# EAGLE design Power Supply V3 (EAGLE 9.1.1)

## Sheet 1 of 2
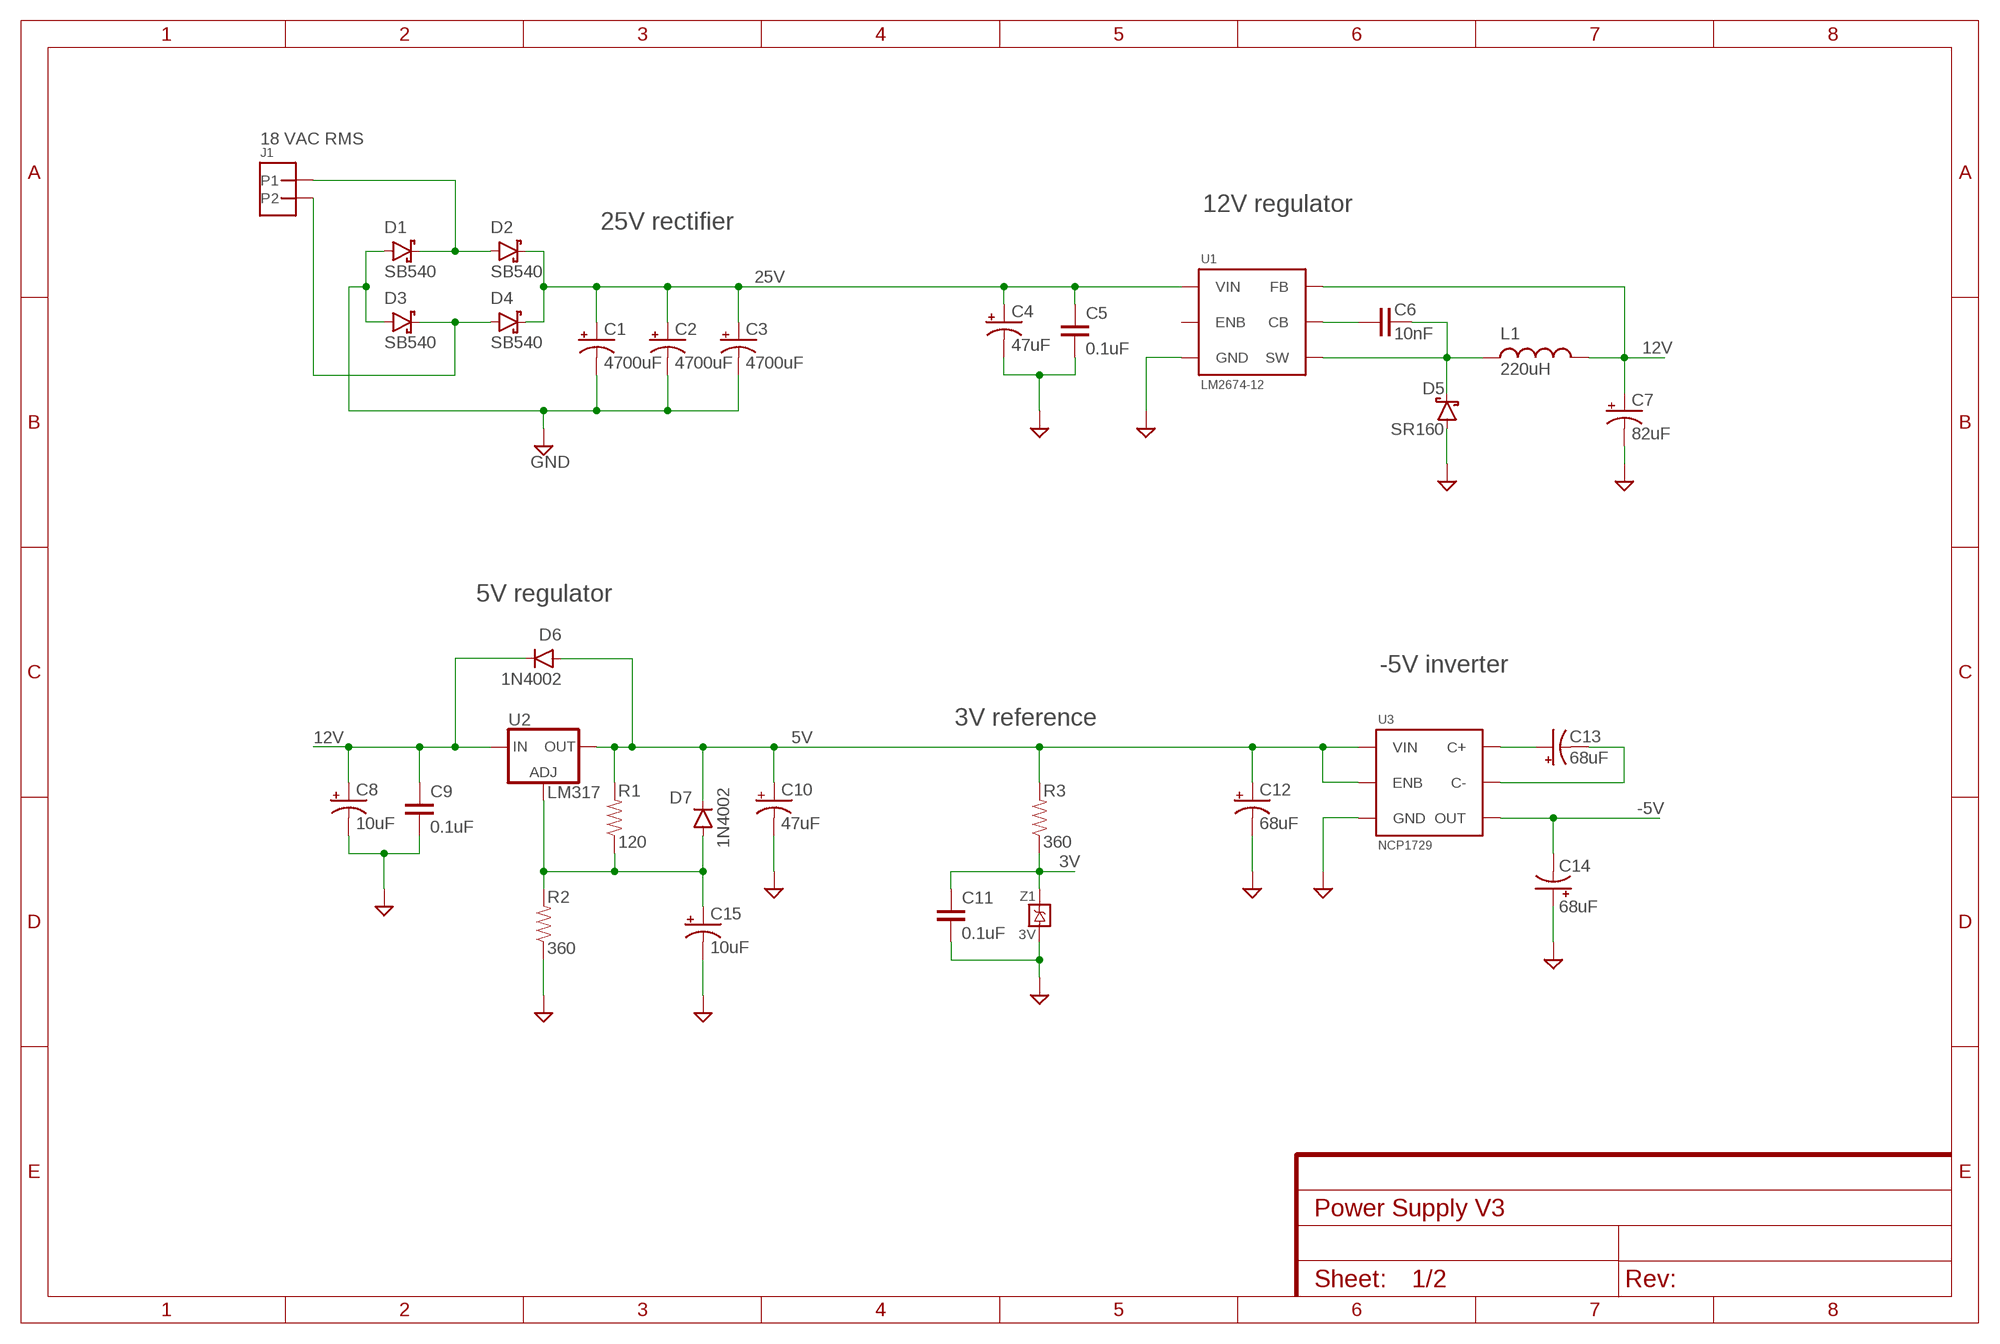
[diagram p0: schematic, sheet 1]
FRAME1 (FRAME-A4L): CNAME: Power Supply; CREVISION: 1; DESIGNER: Isaac Rex

### Parts
C1  4700uF  RADIAL_POL10MM_LEAD-22MM_DIA  [10MM-LEAD_22MM-DIA]
C2  4700uF  RADIAL_POL10MM_LEAD-22MM_DIA  [10MM-LEAD_22MM-DIA]
C3  4700uF  RADIAL_POL10MM_LEAD-22MM_DIA  [10MM-LEAD_22MM-DIA]
C4  47uF  RADIAL_POL2.5MM_LEAD-6.3MM_DIA  [2.5MM_LEAD-6.3MM_DIA]
C5  0.1uF  NON_POL_0805/2012  [0805]
C6  10nF  NON_POL_1206/3216  [1206]
C7  82uF  RADIAL_POL2.5MM_LEAD-6.3MM_DIA  [2.5MM_LEAD-6.3MM_DIA]
C8  10uF  SMD_POL_6032  [6032-28]
C9  0.1uF  NON_POL_0805/2012  [0805]
C10  47uF  RADIAL_POL2.5MM_LEAD-6.3MM_DIA  [2.5MM_LEAD-6.3MM_DIA]
C11  0.1uF  NON_POL_0805/2012  [0805]
C12  68uF  SMD_POL_NICHICON_RFS  [ALUM_SMD_SMALL]
C13  68uF  SMD_POL_NICHICON_RFS  [ALUM_SMD_SMALL]
C14  68uF  SMD_POL_NICHICON_RFS  [ALUM_SMD_SMALL]
C15  10uF  SMD_POL_6032  [6032-28]
D1  SB540  SCHOTTKY_DIODE_DO-201  [DO201-15]
D2  SB540  SCHOTTKY_DIODE_DO-201  [DO201-15]
D3  SB540  SCHOTTKY_DIODE_DO-201  [DO201-15]
D4  SB540  SCHOTTKY_DIODE_DO-201  [DO201-15]
D5  SR160  SCHOTTKY_DIODE_DO-41  [DO41-10]
D6  1N4002  THROUGH_HOLE_DO-41  [DO41-10]
D7  1N4002  THROUGH_HOLE_DO-41  [DO41-10]
J1  MOLEX_46999-0126  [2P_MOLEX_5566]
L1  220uH  1200LRS  [1200LRS]
R1  120  THROUGH_HOLE_1/4W  [1/4W_0.4]
R2  360  THROUGH_HOLE_1/4W  [1/4W_0.4]
R3  360  THROUGH_HOLE_1/4W  [1/4W_0.4]
U1  LM2674-12  LM2674_SOIC-8  [SOIC-8]
U2  LM317  LM317_TO-220  [TO-220]
U3  NCP1729  [TSOP-6]
Z1  3V  LM4040_TO-92  [TO-92_AMMO]

### Nets
3V: C11.1 R3.P$1 Z1.2(V+) ; also sheet 2
5V [supply]: C10.+ C12.+ D6.A D7.C R1.P$2 R3.P$2 U2.2(OUT) U3.2(VIN) U3.5(ENB) ; also sheet 2
12V [supply]: C7.+ C8.+ C9.1 D6.C L1.3 U1.4(FB) U2.3(IN) ; also sheet 2
25V [supply]: C1.+ C2.+ C3.+ C4.+ C5.1 D2.C D4.C U1.7(VIN) ; also sheet 2
-5V [supply]: C14.- U3.1(OUT) ; also sheet 2
CB: C6.1 U1.1(CB)
GND: C1.- C2.- C3.- C4.- C5.2 C7.- C8.- C9.2 C10.- C11.2 C12.- C14.+ C15.- D1.A D3.A D5.A R2.P$1 U1.6(GND) U3.4(GND) Z1.1(V-) ; also sheet 2
N$1 [supply]: D1.C D2.A J1.1
N$2 [supply]: D3.C D4.A J1.2
N$18 [supply]: C13.+ U3.6(C+)
N$21 [supply]: C13.- U3.3(C-)
SET1 [supply]: C15.+ D7.A R1.P$1 R2.P$2 U2.1(ADJ)
SW [supply]: C6.2 D5.C L1.1 U1.8(SW)
Unconnected: U1.5(ENB)

### Notes on the sheet
- 18 VAC RMS
- 12V regulator
- 25V rectifier
- 5V regulator
- -5V inverter
- 3V reference

## Sheet 2 of 2
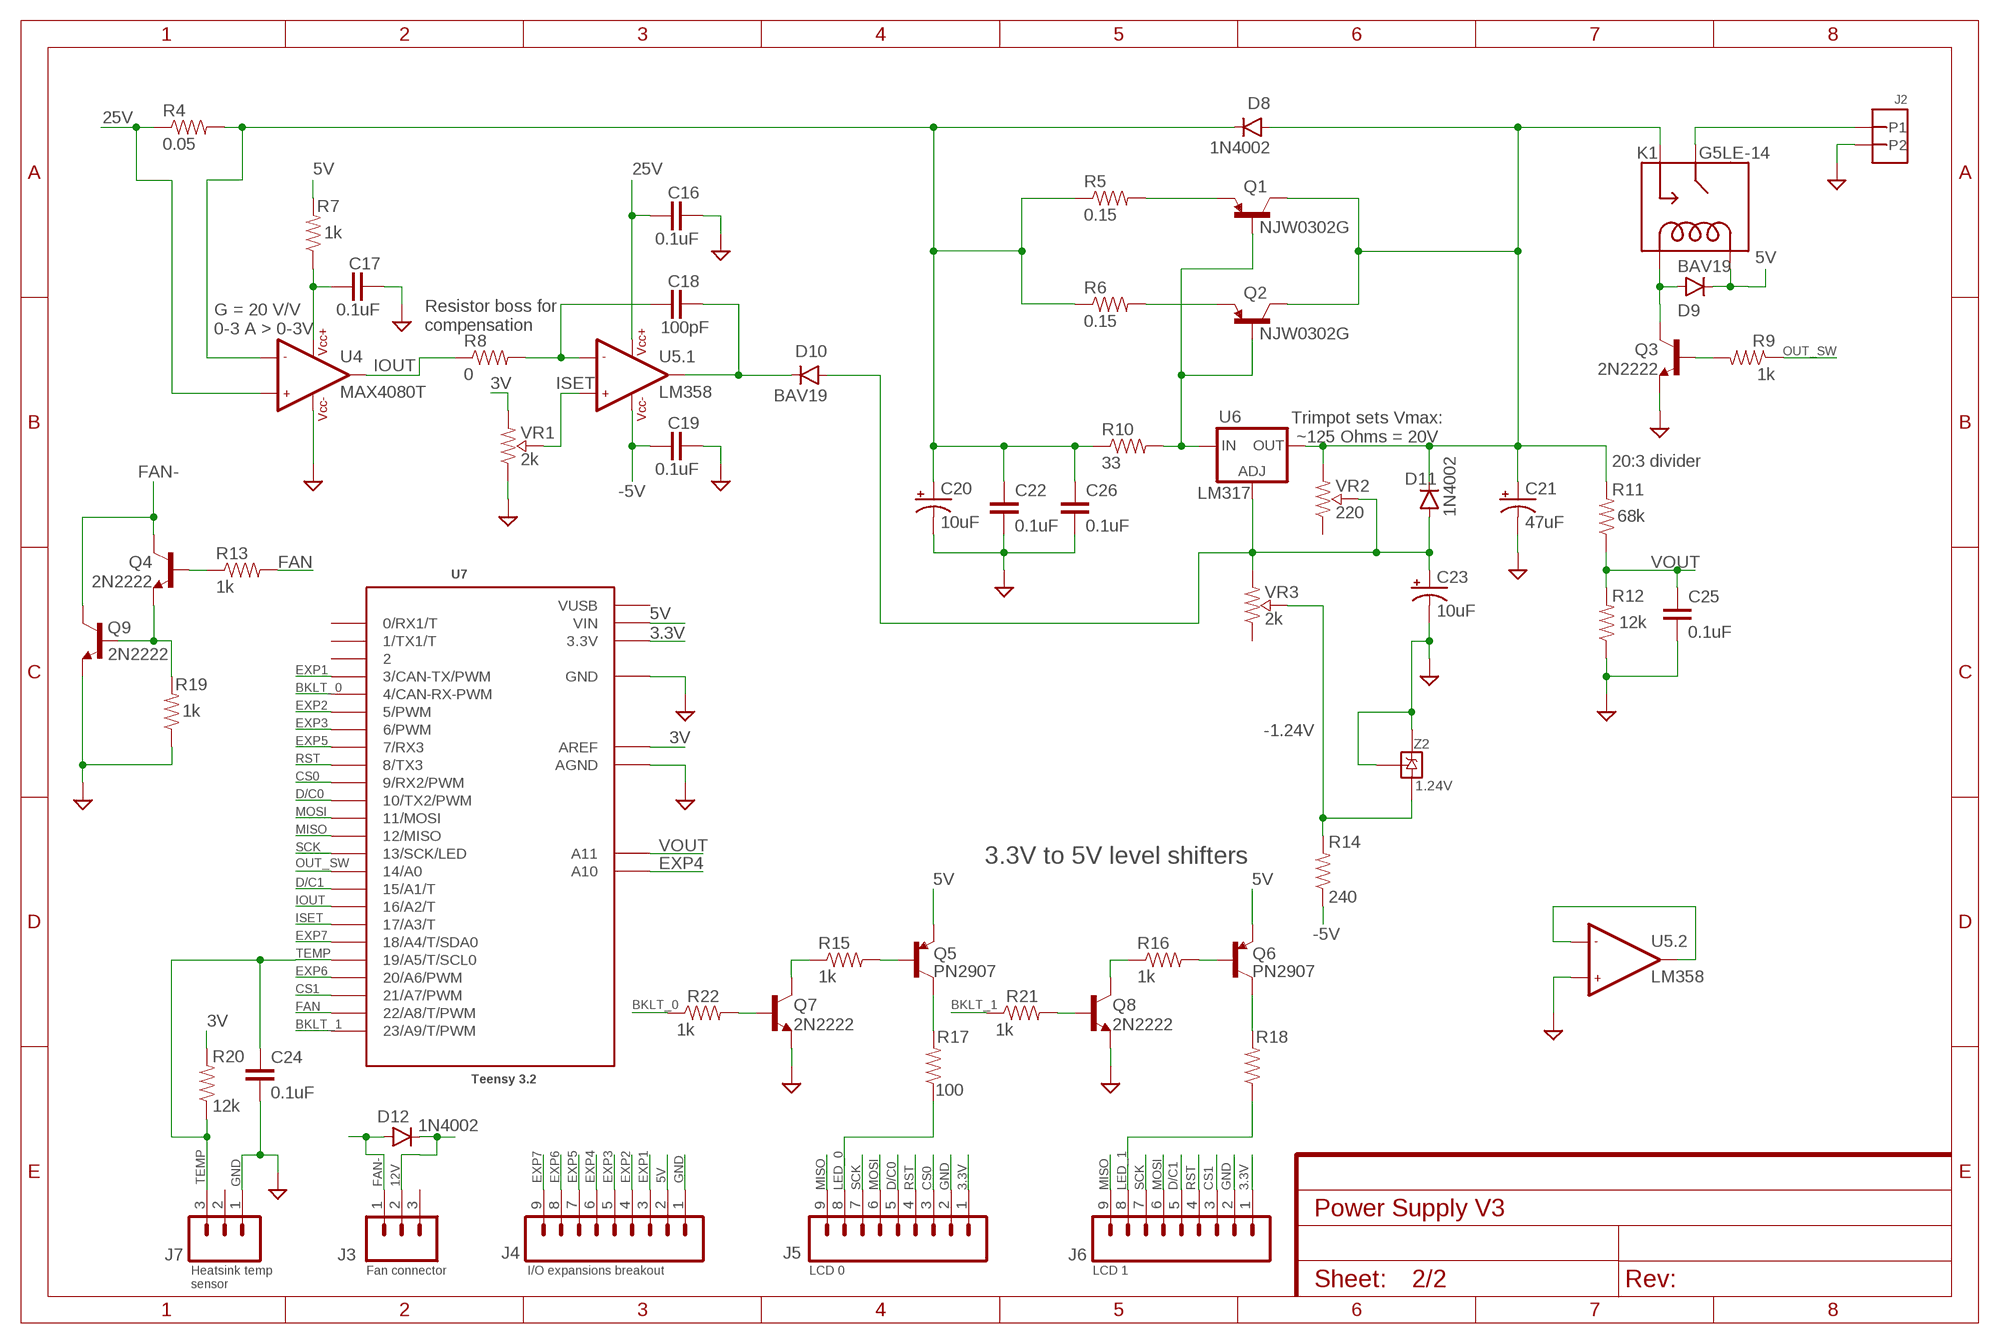
[diagram p1: schematic, sheet 2]
FRAME2 (FRAME-A4L): CNAME: Power Supply; CREVISION: 1; DESIGNER: Isaac Rex

### Parts
C16  0.1uF  NON_POL_0805/2012  [0805]
C17  0.1uF  NON_POL_0805/2012  [0805]
C18  100pF  NON_POL_2.5MM  [2.54MM_LEAD]
C19  0.1uF  NON_POL_0805/2012  [0805]
C20  10uF  SMD_POL_6032  [6032-28]
C21  47uF  RADIAL_POL2.5MM_LEAD-6.3MM_DIA  [2.5MM_LEAD-6.3MM_DIA]
C22  0.1uF  NON_POL_0805/2012  [0805]
C23  10uF  SMD_POL_6032  [6032-28]
C24  0.1uF  NON_POL_0805/2012  [0805]
C25  0.1uF  NON_POL_0805/2012  [0805]
C26  0.1uF  NON_POL_0805/2012  [0805]
D8  1N4002  THROUGH_HOLE_DO-41  [DO41-10]
D9  BAV19  THROUGH_HOLE_DO-35  [DO35-10]
D10  BAV19  THROUGH_HOLE_DO-35  [DO35-10]
D11  1N4002  THROUGH_HOLE_DO-41  [DO41-10]
D12  1N4002  THROUGH_HOLE_DO-41  [DO41-10]
J2  MOLEX_46999-0126  [2P_MOLEX_5566]
J3  3P_XH2.54  [XH-3P_LOCK]
J4  9P_XH2.54LOCK  [9P_XH2.54_LOCK]
J5  9P_XH2.54LOCK  [9P_XH2.54_LOCK]
J6  9P_XH2.54LOCK  [9P_XH2.54_LOCK]
J7  3P_XH2.54  [XH-3P_LOCK]
K1  G5LE-14  RELAY_G5LE-14  [SPST_RELAY_NO]
Q1  NJW0302G  PNP_NJW0302G  [TO-247AD-V]
Q2  NJW0302G  PNP_NJW0302G  [TO-247AD-V]
Q3  2N2222  NPN_2N2222  [TO-92]
Q4  2N2222  NPN_2N2222  [TO-92]
Q5  PN2907  PNP_PN2907  [TO-92_AMMO]
Q6  PN2907  PNP_PN2907  [TO-92_AMMO]
Q7  2N2222  NPN_2N2222  [TO-92]
Q8  2N2222  NPN_2N2222  [TO-92]
Q9  2N2222  NPN_2N2222  [TO-92]
R4  0.05  SMD_2512  [2512]
R5  0.15  THROUGH_HOLE_1/2W  [1/2W_0.5]
R6  0.15  THROUGH_HOLE_1/2W  [1/2W_0.5]
R7  1k  THROUGH_HOLE_1/4W  [1/4W_0.4]
R8  0  THROUGH_HOLE_1/4W  [1/4W_0.4]
R9  1k  THROUGH_HOLE_1/4W  [1/4W_0.4]
R10  33  THROUGH_HOLE_1/4W  [1/4W_0.4]
R11  68k  SMD_0805  [0805]
R12  12k  SMD_0805  [0805]
R13  1k  THROUGH_HOLE_1/4W  [1/4W_0.4]
R14  240  THROUGH_HOLE_1/4W  [1/4W_0.4]
R15  1k  THROUGH_HOLE_1/4W  [1/4W_0.4]
R16  1k  THROUGH_HOLE_1/4W  [1/4W_0.4]
R17  100  THROUGH_HOLE_1/4W  [1/4W_0.4]
R18  100  THROUGH_HOLE_1/4W  [1/4W_0.4]
R19  1k  THROUGH_HOLE_1/4W  [1/4W_0.4]
R20  12k  SMD_0805  [0805]
R21  1k  THROUGH_HOLE_1/4W  [1/4W_0.4]
R22  1k  THROUGH_HOLE_1/4W  [1/4W_0.4]
U4  MAX4080T  MAX4080  [SO08]
U5  LM358  OP-AMP_DUAL_LM358  [DIL-08]
U6  LM317  LM317_TO-220  [TO-220]
U7  Teensy 3.2  TEENSY_3.1_DIL+4  [TEENSY3-DIL+4]
VR1  2k  OFFBOARD_POTXH-3P_LOCK  [XH-3P_LOCK]
VR2  220  TRIM_POTS_THROUGH_HOLE_2.54MM  [THROUGH_HOLE_TRIMPOT]
VR3  2k  OFFBOARD_POTXH-3P_LOCK  [XH-3P_LOCK]
Z2  1.24V  ADJ_VOLTAGE_REF_AZ431L  [TO-92_AMMO]

### Nets
3.3V: J5.1 J6.1 U7.3.3V
3V: R20.2 U7.AREF VR1.3(E) ; also sheet 1
5V [supply]: D9.C J4.2 K1.COIL2 Q5.1(E) Q6.1(E) R7.P$2 U7.VIN ; also sheet 1
12V [supply]: D12.C J3.2 ; also sheet 1
25V [supply]: C16.1 R4.1 U4.1(+IN1) U5.8(.1:VCC+) ; also sheet 1
-1.24V: R14.P$2 VR3.2(S) Z2.2(A)
-5V [supply]: C19.1 R14.P$1 U5.4(.1:VCC-) ; also sheet 1
BKLT_0: R22.P$1 U7.4(4/CAN-RX-PWM)
BKLT_1: R21.P$1 U7.23/A9(23/A9/T/PWM)
CS0: J5.3 U7.9(9/RX2/PWM)
CS1: J6.3 U7.21/A7(21/A7/PWM)
D/C0: J5.5 U7.10(10/TX2/PWM)
D/C1: J6.5 U7.15/A1(15/A1/T)
EXP1: J4.3 U7.3(3/CAN-TX/PWM)
EXP2: J4.4 U7.5(5/PWM)
EXP3: J4.5 U7.6(6/PWM)
EXP4: J4.6 U7.A10
EXP5: J4.7 U7.7(7/RX3)
EXP6: J4.8 U7.20/A6(20/A6/PWM)
EXP7: J4.9 U7.18/A4(18/A4/T/SDA0)
FAN: R13.P$2 U7.22/A8(22/A8/T/PWM)
FAN-: D12.A J3.1 Q4.3(C) Q9.3(C)
GND: C16.2 C17.2 C19.2 C20.- C21.- C22.2 C23.- C24.2 C25.2 C26.2 J2.2 J4.1 J5.2 J6.2 J7.1 Q3.1(E) Q7.1(E) Q8.1(E) Q9.1(E) R12.1 R19.P$1 U4.4(VCC-) U5.5(.2:+IN2) U7.AGND U7.GND VR1.1(A) Z2.1(REF) Z2.3(C) ; also sheet 1
IN: Q1.1(B) Q2.1(B) R10.P$2 U6.3(IN) ; also sheet 1
IOUT: R8.P$1 U4.5(OUT1) U7.16/A2(16/A2/T)
ISET: U5.3(.1:+IN1) U7.17/A3(17/A3/T) VR1.2(S)
LED_0: J5.8 R17.P$1
LED_1: J6.8 R18.P$1
MISO: J5.9 J6.9 U7.12(12/MISO)
MOSI: J5.6 J6.6 U7.11(11/MOSI)
N$5: C17.1 R7.P$1 U4.2(VCC+)
N$7: C20.+ C22.1 C26.1 D8.C R4.2 R5.P$1 R6.P$1 R10.P$1 U4.8(-IN1)
N$8: C18.2 D10.C U5.1(.1:OUT1)
N$9: Q1.3(E) R5.P$2
N$10: Q2.3(E) R6.P$2
N$11: C18.1 R8.P$2 U5.2(.1:-IN1)
N$12: Q8.2(B) R21.P$2
N$13 [supply]: J2.1 K1.COM(MAIN)
N$14: Q7.2(B) R22.P$2
N$15: D9.A K1.COIL1 Q3.3(C)
N$19: Q3.2(B) R9.P$2
N$20: Q5.3(C) R17.P$2
N$22: Q7.3(C) R15.P$1
N$23: Q6.3(C) R18.P$2
N$24: Q5.2(B) R15.P$2
N$25: Q8.3(C) R16.P$1
N$26: Q6.2(B) R16.P$2
N$27: Q4.1(E) Q9.2(B) R19.P$2
N$28: Q4.2(B) R13.P$1
OP2: U5.6(.2:-IN2) U5.7(.2:OUT2)
OUT [supply]: C21.+ D8.A D11.C K1.NO Q1.2(C) Q2.2(C) R11.2 U6.2(OUT) VR2.3(E) ; also sheet 1
OUT_SW: R9.P$1 U7.14/A0
RST: J5.4 J6.4 U7.8(8/TX3)
SCK: J5.7 J6.7 U7.13(13/SCK/LED)
SET: C23.+ D10.A D11.A U6.1(ADJ) VR2.2(S) VR3.3(E) ; also sheet 1
TEMP: C24.1 J7.3 R20.1 U7.19/A5(19/A5/T/SCL0)
VOUT: C25.1 R11.1 R12.2 U7.A11
Unconnected: J3.3 J7.2 U7.0(0/RX1/T) U7.1(1/TX1/T) U7.2 VR2.1(A) VR3.1(A)

### Notes on the sheet
- Resistor boss for 
  compensation
- G = 20 V/V
  0-3 A > 0-3V
- Trimpot sets Vmax:
   ~125 Ohms = 20V
- 20:3 divider
- 3.3V to 5V level shifters
- Heatsink temp 
  sensor
- Fan connector | I/O expansions breakout | LCD 0 | LCD 1

## Power pins joined to a net without a drawn wire
VUSB: U7.VUSB

## Library data of the parts
C1-C4 C7 C10 C21 = Capacitors:RADIAL_POL
C5 C6 C9 C11 C16-C19 C22 C24-C26 = Capacitors:NON_POL
C8 C12-C15 C20 C23 = Capacitors:SMD_POL
D1-D5 = Diodes:SCHOTTKY_DIODE
D6-D12 = Diodes:THROUGH_HOLE: DIODE silicon-epitaxial planar diode
J1 J2 = Connectors:MOLEX_46999-0126: 2-pin
J3 J7 = Connectors:3P_XH2.54: 3 pin
J4-J6 = Connectors:9P_XH2.54: 9-pin
K1 = Electromechanical:RELAY
L1 = Inductors:1200LRS: Murata 1200LRS series inductors
Q1 Q2 = Transistors:PNP; SPICEMODEL: NJW0302G; SPICEPREFIX: Q
Q3 Q4 Q7-Q9 = Transistors:NPN
Q5 Q6 = Transistors:PNP
R1-R3 R5 R6 R8-R10 R13-R18 R21 R22 = Resistors:THROUGH_HOLE
R4 R11 R12 R20 = Resistors:SMD
R7 R19 = Resistors:THROUGH_HOLE; SPICEPREFIX: R
U1 = Voltage Regulators:LM2674: Switching voltage regulator; VALUE: LM2674-
U2 U6 = Voltage Regulators:LM317: Linear voltage regulator; SPICEMODEL: LM317; SPICEPREFIX: X
U3 = Voltage Regulators:NCP1729: Switched capacitor voltage inverter
U4 = Amplifiers:MAX4080: Current sense amplifier
U5 = Amplifiers:OP-AMP_DUAL: Op-amp
U7 = Teensy Boards:TEENSY_3.1_DIL+4: Teensy 3.1 and 3.2 in a DIL package with the inner 4 pins
VR1 VR3 = Potentiometer:OFFBOARD_POT; SPICEMODEL: POT; SPICEPREFIX: X
VR2 = Potentiometer:TRIM_POTS
Z1 = Voltage Reference:LM4040
Z2 = Voltage Reference:ADJ_VOLTAGE_REF

## Net classes
1 supply: width 0.305 mm, clearance 0.305 mm

## Board
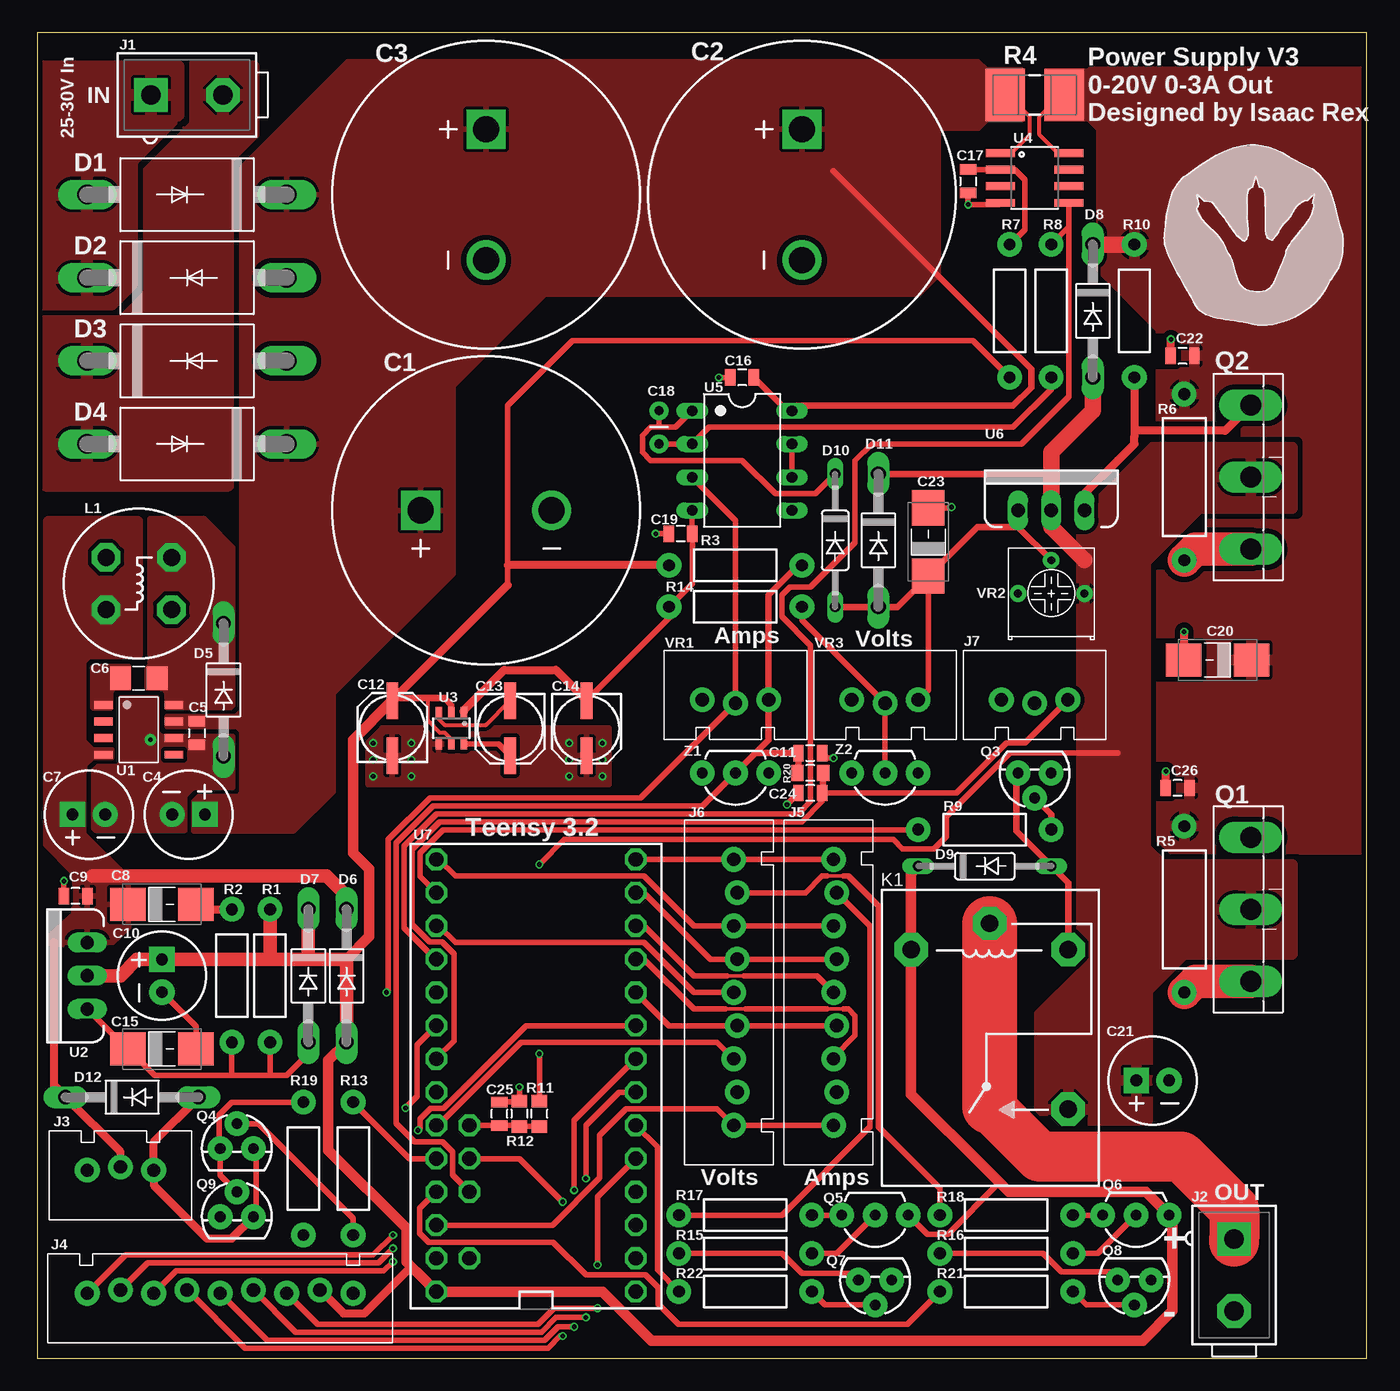
[diagram p2: board, top side]
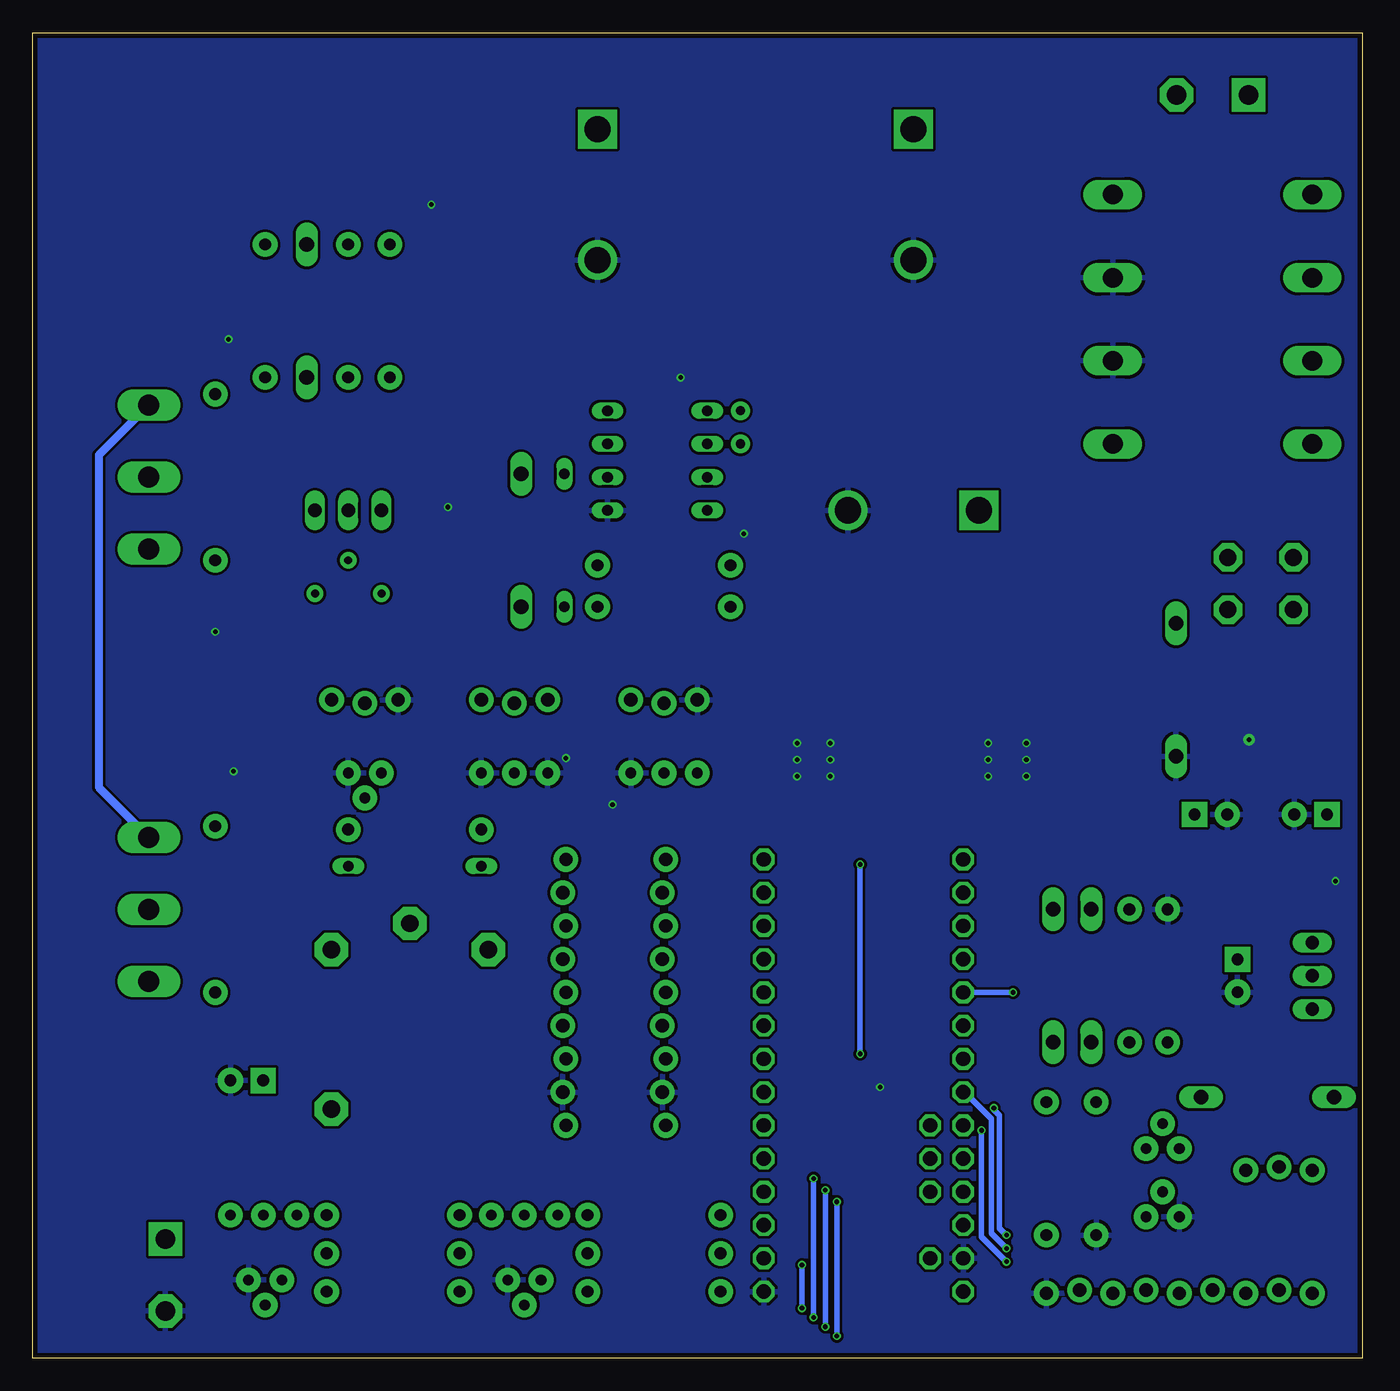
[diagram p3: board, bottom side, seen from below]

Size 101.58 x 101.27 mm. Coordinates in mm from the lower left corner, seen from the top.
Outline: 0,0 101.58,0 101.58,101.27 0,101.27 0,0
Copper layers (1*16): Top 0.035559375mm / dielectric 1.6mm / Bottom 0.035559375mm
Design rules "OshPark-2layer *": minimum track width 8mil, minimum drill 10mil, track to track 8mil, track to pad 8mil, pad to pad 8mil, via to via 8mil, smd to smd 6mil, copper to edge 15mil, drill to drill 6mil, minimum pad ring 5mil, minimum via ring 5mil, stop-mask expansion 2.5mil, vias tented up to drill 0mil, thermal gap 10mil

### Footprints (pad centres in the part's own frame; a part is rotated, then mirrored left to right if it is on the bottom)
10MM-LEAD_22MM-DIA = drill 2 square: + 5,0 | drill 2: - -5,0
2.5MM_LEAD-6.3MM_DIA = drill 0.9 pad 1.93 square: + 1.25,0 | drill 0.9 pad 1.93: - -1.25,0
0805 = smd 0.8 x 1.25: 1 -0.9,0; 2 0.9,0
1206 = smd 1.6 x 1.8: 1 -1.4,0; 2 1.4,0
6032-28 = smd 2.7 x 2.5: + 2.6,0; - -2.6,0
ALUM_SMD_SMALL = smd 2.8 x 0.9: + 2.1,-0.2; - -2.1,-0.2
2.54MM_LEAD = drill 0.7 pad 1.422: 1 -1.27,0; 2 1.27,0
DO201-15 = drill 1.499 long: A 7.62,0; C -7.62,0
DO41-10 = drill 1.118 long: A 5.08,0; C -5.08,0
DO35-10 = drill 0.813 long: A 5.08,0; C -5.08,0
2P_MOLEX_5566 = drill 1.5 pad 2.54 square: 1 0,2.75 | drill 1.5 pad 2.54 octagon: 2 0,-2.75
XH-3P_LOCK = drill 1.016 pad 1.88: 1 -2.54,0.127; 2 0,-0.127; 3 2.54,0.127
9P_XH2.54_LOCK = drill 1.016 pad 1.88: 1 0,0.127; 2 2.54,-0.127; 3 5.08,0.127; 4 7.62,-0.127; 5 10.16,0.127; 6 12.7,-0.127; 7 15.24,0.127; 8 17.78,-0.127; 9 20.32,0.127
SPST_RELAY_NO = drill 1.32 pad 2.54 octagon: COIL1 -6.45,6.25; COIL2 -6.45,-5.75; COM -8.45,0.25; NO 5.75,6.25
1200LRS = drill 1.3 pad 2.184 octagon: 1 -2,2.5; 2 -2,-2.5; 3 2,-2.5; 4 2,2.5
TO-247AD-V = drill 1.6 long: 1 -5.5,-2.54; 2 0,-2.54; 3 5.5,-2.54
TO-92 = drill 0.813 pad 1.88: 1 -1.27,0; 2 0,1.905; 3 1.27,0
TO-92_AMMO = drill 0.813 pad 1.88: 1 -2.54,0; 2 0,0; 3 2.54,0
1/4W_0.4 = drill 0.9 pad 1.88: P$1 -5.08,0; P$2 5.08,0
2512 = smd 3 x 4: 1 -2.25,0; 2 2.25,0
1/2W_0.5 = drill 0.9 pad 1.88: P$1 -6.35,0; P$2 6.35,0
0805' = smd 0.95 x 1.2: 1 -0.975,0; 2 0.975,0
SOIC-8 = smd 0.6 x 1.4: 1 -1.905,-2.7; 2 -0.635,-2.7; 3 0.635,-2.7; 4 1.905,-2.7; 5 1.905,2.7; 6 0.635,2.7; 7 -0.635,2.7; 8 -1.905,2.7
TO-220 = drill 1.016 long: 1 -2.54,0; 2 0,0; 3 2.54,0
TSOP-6 = smd 0.508 x 0.8: 1 -0.95,-1.212; 2 0,-1.212; 3 0.95,-1.212; 4 0.95,1.212; 5 0,1.212; 6 -0.95,1.212
SO08 = smd 0.61 x 2.21: 1 -1.905,-2.616; 2 -0.635,-2.616; 3 0.635,-2.616; 4 1.905,-2.616; 5 1.905,2.616; 6 0.635,2.616; 7 -0.635,2.616; 8 -1.905,2.616
DIL-08 = drill 0.813 long: 1 -3.81,-3.81; 2 -1.27,-3.81; 3 1.27,-3.81; 4 3.81,-3.81; 5 3.81,3.81; 6 1.27,3.81; 7 -1.27,3.81; 8 -3.81,3.81
TEENSY3-DIL+4 = drill 1.1 octagon: 0 -7.62,13.97; 1 -7.62,11.43; 2 -7.62,8.89; 3 -7.62,6.35; 3.3V 7.62,11.43; 4 -7.62,3.81; 5 -7.62,1.27; 6 -7.62,-1.27; 7 -7.62,-3.81; 8 -7.62,-6.35; 9 -7.62,-8.89; 10 -7.62,-11.43; 11 -7.62,-13.97; 12 -7.62,-16.51; 13 7.62,-16.51; 14/A0 7.62,-13.97; 15/A1 7.62,-11.43; 16/A2 7.62,-8.89; 17/A3 7.62,-6.35; 18/A4 7.62,-3.81; 19/A5 7.62,-1.27; 20/A6 7.62,1.27; 21/A7 7.62,3.81; 22/A8 7.62,6.35; 23/A9 7.62,8.89; A10 5.08,6.35; A11 5.08,3.81; AGND 7.62,13.97; AREF 5.08,8.89; GND -7.62,16.51; VIN 7.62,16.51; VUSB 5.08,13.97
THROUGH_HOLE_TRIMPOT = drill 0.6 pad 1.27: 1 -2.54,0; 2 0,2.54; 3 2.54,0

### Placement (x,y rotation side)
C1  34.29,64.77 180 top
C2  58.42,88.9 90 top
C3  34.29,88.9 90 top
C4  11.56,41.53 0 top
C5  12.19,47.75 270 top
C6  7.75,51.94 0 top
C7  3.94,41.53 180 top
C8  9.53,34.67 180 top
C9  2.92,35.31 180 top
C10  9.53,29.21 90 top
C11  59.05,46.23 0 top
C12  26.92,48.13 90 top
C13  36.32,48.13 270 top
C14  42.16,48.13 270 top
C15  9.53,23.62 180 top
C16  53.85,74.93 180 top
C17  71.12,89.92 270 top
C18  47.5,71.12 90 top
C19  49.15,62.99 180 top
C20  90.17,53.34 0 top
C21  85.22,21.21 180 top
C22  87.5,76.58 180 top
C23  68.07,62.36 270 top
C24  59.05,43.18 180 top
C25  35.31,18.67 90 top
C26  87.12,43.56 180 top
D1  11.43,82.55 0 top
D2  11.43,88.9 180 top
D3  11.43,76.2 0 top
D4  11.43,69.85 180 top
D5  14.22,51.05 270 top
D6  23.62,29.21 270 top
D7  20.7,29.21 270 top
D8  80.64,80.01 270 top
D9  72.39,37.59 0 top
D10  60.96,62.48 270 top
D11  64.26,62.48 270 top
D12  7.24,19.94 0 top
J1  11.43,96.52 90 top
J2  91.44,6.35 0 top
J3  6.35,14.48 180 top
J4  24.13,5.08 180 top
J5  60.96,17.78 90 top
J6  53.34,17.78 90 top
J7  76.2,50.16 0 top
K1  72.52,24.77 270 top
L1  7.75,59.18 270 top
Q1  95.25,34.29 270 top
Q2  95.25,67.31 270 top
Q3  76.2,44.7 180 top
Q4  15.24,16 0 top
Q5  64.01,10.92 180 top
Q6  83.95,10.92 180 top
Q7  64.01,5.97 180 top
Q8  83.82,5.97 180 top
Q9  15.24,10.79 0 top
R1  17.78,29.21 90 top
R2  14.86,29.21 270 top
R3  53.34,60.58 180 top
R4  76.2,96.52 0 top
R5  87.63,34.29 270 top
R6  87.63,67.31 270 top
R7  74.3,80.01 270 top
R8  77.47,80.01 270 top
R9  72.39,40.39 0 top
R10  83.82,80.01 270 top
R11  68k  [0805']  38.35,18.67 90 top
R12  12k  [0805']  36.83,18.67 270 top
R13  24.13,14.48 90 top
R14  53.34,57.4 0 top
R15  54.1,8 0 top
R16  74.04,8 0 top
R17  54.1,10.92 0 top
R18  74.04,10.92 0 top
R19  20.32,14.48 90 top
R20  12k  [0805']  59.05,44.7 180 top
R21  74.04,5.08 0 top
R22  54.1,5.08 0 top
U1  7.75,48.01 270 top
U2  3.81,29.21 90 top
U3  31.62,48.13 180 top
U4  76.2,90.17 270 top
U5  53.85,68.58 270 top
U6  77.47,64.77 0 top
U7  38.1,21.59 180 top
VR1  53.34,50.16 0 top
VR2  77.47,58.42 0 top
VR3  64.77,50.16 0 top
Z1  53.34,44.7 180 top
Z2  64.77,44.7 180 top

### Tracks (layer width: path | path; a pad name or v marks a point on that pad's centre or on a via)
3.3V
  Top 0.406: J5.1 J6.1 51.94,19.05 44.99,19.05 42.97,17.02 42.97,13.76 39.37,10.16 U7.3.3V
3V
  Top 0.406: U7.AREF 31.71,14.01 31.71,15.75 30.95,16.51 28.83,16.51 27.42,17.92 27.42,39.37 30.24,42.19 50.83,42.19 Z1.2
  Top 0.508: Z1.2 54.48,45.85 | 54.48,45.85 55.87,47.23 55.88,47.23 55.88,48.5 VR1.3 55.88,58.29 58.17,60.58 R3.P$1 | R20.2 58.16,44.78 C11.1 54.86,46.23 54.48,45.85
5V
  Top 0.305: 29.84,50.42 29.84,48.7 30.77,47.78 31.15,47.78 31.62,47.3 U3.5
  Top 0.406: R7.P$2 71.5,77.72 40.89,77.72 35.95,72.78 35.95,60.58 35.95,59.05 | Q5.1 68,9.47 69.56,9.47 73.44,13.35 73.44,13.49
  Top 0.508: U3.2 31.62,49.91 31.11,50.42 29.84,50.42 27.31,50.42 C12.+
  Top 0.61: R3.P$2 35.95,60.58 | 35.95,59.05 C12.+ | 86.74,10.67 Q6.1 | J4.2 23.39,3.4 24.99,3.4 28.57,6.99
  Top 0.813: D9.C 66.77,37.05 K1.COIL2 66.77,20.16 72.58,14.35 73.44,13.49 74.23,12.7 84.71,12.7 Q6.1 | 86.74,10.67 86.74,3.61 84.45,1.32 46.94,1.32 43.18,5.08 U7.VIN 29.21,6.35 28.57,6.99 28.19,7.37 28.19,9.91 22.23,15.88 22.23,22.73 D6.A | C12.+ 24.13,47.24 24.13,38.61 25.36,37.38 25.36,32.2 23.62,30.46
  Top 1.016: R1.P$2 17.78,30.46 | U2.2 6.35,29.21 7.6,30.46 C10.+ 17.78,30.46 | 20.7,30.46 23.62,30.46 D6.A | D7.C 20.7,30.46 | 17.78,30.46 20.7,30.46
12V
  Top 0.61: J3.2 6.35,15.75 D12.C 1.27,20.83 1.27,31.75
  Top 1.016: 4.19,36.83 22.1,36.83 23.62,35.31 D6.C
  pour Top (isolate 0.305, rank 3, no thermals): 7.87,53.85 7.87,63.88 arc90 7.62,64.14 0.89,64.14 arc90 0.64,63.88 0.64,57.02 0.64,40.13 3.56,40.13 3.56,44.83 4.45,45.72 5.71,45.72 5.71,46.48 4.19,46.48 3.56,47.12 3.56,53.21 3.94,53.59 7.62,53.59 arc90
  pour Top: 5.62,31.62 7.24,33.17 7.24,36.83 6.73,36.83 3.56,40.01 3.56,41.53 0.64,41.53 0.64,39.24 2.79,37.08 2.79,33.89 1.02,32.37 1.02,31.62
25V
  Top 0.305: U4.1 74.42,92.08 75.82,93.47 75.82,94.87 74.17,96.52 | 74.17,96.52 R4.1 | 74.17,96.52
  Top 0.406: 57.29,72.39 U5.8
  Top 0.508: C16.1 57.29,72.39 | 60.83,90.68 75.95,75.56 75.95,74.17 74.55,72.77 58.04,72.77 U5.8
  pour Top (no thermals): 9.91,49.02 9.91,48.26 15.3,48.26 15.62,47.94 15.62,43.18 15.37,42.93 12.38,42.93 11.94,42.48 11.94,40.26 18.67,40.26 18.67,59.44 15.62,59.44 15.62,49.4 15.24,49.02
  pour Top (isolate 0.406): 38.73,81.28 67.31,81.28 68.83,82.8 68.83,99.06 23.75,99.06 16.13,91.44 15.62,90.93 15.62,58.8 15.62,40.26 19.56,40.26 22.61,43.31 22.61,50.8 31.75,59.94 31.75,74.3
  pour Top (no thermals): 75.18,98.42 75.18,94.61 72.52,94.61 71.88,93.98 61.47,93.98 61.47,99.06 71.88,99.06 72.52,98.42
-1.24V
  Top 0.406: R14.P$2 58.42,56.39 VR3.2 Z2.2
-5V
  Top 0.406: R14.P$1 50.05,59.19 C19.1 50.04,63 U5.4
  Top 0.508: C14.- 48.26,56.53 R14.P$1
  Top 0.61: C14.- 39.62,52.58 35.68,52.58 32.57,49.47 U3.1
BKLT_0
  Top 0.406: U7.4 47.37,16.13 47.37,6.73 R22.P$1
BKLT_1
  Top 0.406: U7.23/A9 29.21,11.43 29.21,9.53 29.88,8.85 39.41,8.85 41.91,6.35 46.48,6.35 47.42,5.41 47.42,4.14 48.97,2.59 66.47,2.59 R21.P$1
CB
  pour Top (isolate 0.305, rank 6, no thermals): 6.99,51.18 6.99,52.83 4.32,52.83 4.06,52.58 4.06,49.91 4.32,49.66 5.59,49.66 5.59,50.42 5.59,50.93 5.84,51.18
CS0
  Top 0.254: 52.58,26.67 54.1,26.67 | 60.33,26.67 61.59,26.67
  Top 0.406: 52.58,26.67 50.16,26.67 46.35,30.48 U7.9 | 54.1,26.67 60.33,26.67 | 61.59,26.67 61.98,26.67 62.48,26.16 62.48,24.64 60.83,22.99 J5.3
CS1
  Top 0.406: J6.3 51.94,24.13 36.96,24.13 30.61,17.78 U7.21/A7
D/C0
  Top 0.254: 52.7,29.21 53.98,29.21
  Top 0.406: U7.10 46.35,33.02 50.16,29.21 52.7,29.21 | 53.98,29.21 59.56,29.21 J5.5
D/C1
  Top 0.406: J6.5 50.16,27.94 46.35,31.75 31.94,31.75 30.67,33.02 U7.15/A1
EXP1  (via drill 0.35)
  Top 0.406: U7.3 42.8,12.32 v42.8,7.11 | v42.8,3.81 39.48,3.81 38.26,2.59 21.4,2.59 19.05,4.94 J4.3
  Bottom 0.406: v42.8,3.81 v42.8,7.11
EXP2  (via drill 0.35)
  Top 0.406: U7.5 44.45,20.32 41.91,17.78 v41.91,13.72 | v41.91,3.1 39.63,3.1 38.51,1.98 19.74,1.98 J4.4
  Bottom 0.406: v41.91,3.1 v41.91,13.72
EXP3  (via drill 0.35)
  Top 0.406: U7.6 41.02,18.16 v41.02,12.83 | v41.02,2.39 39.78,2.39 38.76,1.37 17.55,1.37 J4.5
  Bottom 0.406: v41.02,2.39 v41.02,12.83
EXP4  (via drill 0.35)
  Top 0.406: v40.13,1.69 39.94,1.69 39.02,0.76 15.88,0.76 J4.6 | v40.13,11.94 36.83,15.24 U7.A10
  Bottom 0.406: v40.13,1.69 v40.13,11.94
EXP5  (via drill 0.35)
  Top 0.406: J4.7 10.6,6.66 26.47,6.66 v27.18,7.37 | v29.08,17.4 29.25,17.57 29.25,18.29 30.05,19.09 31.03,19.09 37.34,25.4 U7.7
  Bottom 0.406: v27.18,7.37 29.08,9.27 v29.08,17.4
EXP6  (via drill 0.35)
  Top 0.406: v27.18,8.38 26.07,7.27 8.41,7.27 J4.8
  Bottom 0.406: v27.18,8.38 28.32,9.52 28.32,18.28 30.35,20.32 U7.20/A6
EXP7  (via drill 0.35)
  Top 0.406: J4.9 6.74,7.88 25.66,7.88 v27.18,9.4 | U7.18/A4 29.03,23.95 29.03,20 v28.14,19.11
  Bottom 0.406: v27.18,9.4 27.7,9.93 27.7,18.53 28.14,18.97 v28.14,19.11
FAN
  Top 0.406: R13.P$2 28.45,15.24 U7.22/A8
FAN-
  Top 0.406: Q9.3 16.71,11 16.71,15.8 Q4.3
  Top 0.61: D12.A 8.89,16.51 J3.1 8.89,13.21 12.95,9.14 14.86,9.14 Q9.3
GND  (via drill 0.35, 0.35 pad 0.9)
  Top 0.406: C15.- 12.12,25.36 C10.- | C25.2 36.76,19.57 R12.1 v36.83,20.7 | C23.- 69.78,64.96 v69.85,65.02 | C16.2 v52.07,74.93 | U4.4 73.46,88.14 v71.12,88.14 C17.2 | C9.2 2.02,36.44 v2.03,36.45 | v57.28,42.29 57.28,42.3 C24.2 | v60.83,45.85 60.34,45.85 C11.2 | C19.2 v47.24,62.99
  Top 0.61: C20.- 87.63,53.4 v87.63,55.5 | C22.2 v86.6,77.84 v86.61,77.85 | C26.2 v86.22,44.82 v86.23,44.83 | C8.- 12.51,34.29 R2.P$1
  other vias: 8.64,47.24 40.64,46.99 40.64,45.72 40.64,44.45 43.18,44.45 43.18,45.72 43.18,46.99 28.57,46.99 28.57,45.72 28.57,44.45 25.65,44.45 25.65,45.72 25.65,46.99
  pour Top (isolate 0.305, rank 2, no thermals): 9.14,50.42 6.35,50.42 6.35,49.28 6.35,47.12 6.35,45.47 arc-90 6.1,45.21 4.64,45.21 4.32,44.89 4.32,40.58 arc90 4.57,40.32 11.18,40.32 arc90 11.43,40.58 11.43,42.74 12.13,43.43 14.86,43.43 15.49,44.07 15.49,46.99 14.99,47.5 9.78,47.5 9.59,47.5 arc-90 9.14,47.94
  pour Top (isolate 0.305): 25.27,48.13 25.27,43.81 43.69,43.81 43.69,48.13
  pour Bottom (isolate 0.203): 0,0 0,101.22 101.6,101.22 101.6,0
IN
  Top 0.61: R10.P$2 83.82,73.03 83.82,71.75 83.82,71.25 83.82,71.12 83.82,70.99 83.82,70.87 | U6.3 80.01,66.04 82.55,68.58 83.82,69.85 83.82,70.48 83.82,70.87 | Q2.1 90.77,70.87 83.82,70.87
  Bottom 0.61: Q1.1 96.52,43.6 96.52,69 Q2.1
IOUT
  Top 0.406: R8.P$1 78.82,86.44 U4.5 78.82,73.48 75.18,69.85 63.75,69.85 62.48,68.58 62.48,62.3 59.08,58.9 57.51,58.9 56.9,58.29 56.9,56.64 59.09,54.45 59.09,42.51 58.16,41.58 30.49,41.58 28.03,39.12 28.03,32.87 30.42,30.48 U7.16/A2
ISET  (via drill 0.35)
  Top 0.406: v26.67,27.94 26.81,28.08 26.81,39.62 29.99,42.8 46.1,42.8 VR1.2 53.34,64.01 U5.3
  Bottom 0.406: v26.67,27.94 U7.17/A3
LED_0
  Top 0.406: J5.8 63.63,33.02 63.63,17.65 56.9,10.92 R17.P$1
LED_1
  Top 0.254: 61.59,36.83 60.33,36.83
  Top 0.406: J6.8 58.67,35.56 59.94,36.83 60.33,36.83 | 61.59,36.83 61.98,36.83 64.26,34.54 64.26,17.65 68.96,12.95 R18.P$1
MISO
  Top 0.406: U7.12 J6.9 J5.9
MOSI
  Top 0.406: U7.11 46.35,35.56 51.44,30.48 J6.6 J5.6
N$1
  pour Top (isolate 0.406): 10.79,98.68 0.51,98.68 0.51,80.52 5.71,80.52 7.24,82.04 7.24,91.44 10.79,95
N$2
  pour Top (isolate 0.406, rank 2): 16.51,96.52 16.51,98.68 11.43,98.68 11.43,93.98 8,90.55 8,82.8 5.08,79.88 0.64,79.88 0.64,66.67 14.61,66.67 14.61,91.06 16.51,92.96
N$5
  Top 0.406: R7.P$1 75.44,86.23 75.44,90.04 74.68,90.81 U4.2 71.13,90.81 C17.1
N$7
  Top 0.305: U4.8 77.98,92.08 76.58,93.47 76.58,94.87 78.23,96.52 R4.2
  Top 1.27: D8.C R10.P$1
  pour Top (isolate 0.406, rank 2): 80.52,94.74 80.52,98.3 101.22,98.3 101.22,38.86 85.85,38.86 85.85,78.61 81.28,83.19 81.28,87.63 81.28,93.98
  pour Top (no thermals): 77.47,94.74 77.47,98.3 81.92,98.3 81.92,94.74
N$8
  Top 0.406: 47.5,71.12 46.86,71.12 46.23,70.48 46.23,69.22 46.86,68.58 53.85,68.58 56.39,66.04 59.44,66.04 D10.C | 47.5,71.12 48.77,71.12 U5.1 | C18.2 47.5,71.12
N$9
  Top 2.54: R5.P$2 88.48,28.79 Q1.3
N$10
  Top 2.54: R6.P$2 88.48,61.81 Q2.3
N$11
  Top 0.406: C18.1 U5.2 51.31,71.12 74.55,71.12 77.47,74.04 R8.P$2
N$12
  Top 0.406: Q8.2 80.14,4.06 R21.P$2
N$13
  Top 3.175: J2.1 91.44,8.89 | K1.COM 72.75,33.2
  Top 3.81: 72.75,19.23 76.56,15.41 87.4,15.41 91.44,11.37 J2.1 91.44,8.89
  Top 4.191: 72.75,33.2 72.75,19.23
N$14
  Top 0.406: Q7.2 60.2,4.06 R22.P$2
N$15
  Top 0.508: K1.COIL1 78.77,36.3 D9.A 74.8,40.26 74.8,44.58 Q3.3
N$18
  Top 0.406: U3.6 35.23,46.92 C13.+
N$19
  Top 0.508: R9.P$2 77.47,41.53 Q3.2
N$20
  Top 0.406: R17.P$2 Q5.3
N$21
  Top 0.305: U3.3 30.67,48.83 31.11,48.39 34.28,48.39 C13.-
N$22
  Top 0.406: R15.P$1 56.9,8 58.42,6.48 62.23,6.48 Q7.3
N$23
  Top 0.406: Q6.3 R18.P$2
N$24
  Top 0.406: R15.P$2 61.09,8 Q5.2
N$25
  Top 0.406: R16.P$1 76.83,8 78.23,6.6 81.92,6.6 Q8.3
N$26
  Top 0.406: R16.P$2 81.03,8 Q6.2
N$27
  Top 0.406: R19.P$2 14.86,19.56 13.89,18.59 13.89,16.08 Q4.1 13.97,13.97 Q9.2
N$28
  Top 0.406: R13.P$1 24.13,10.67 16.89,17.91 Q4.2
OP2
  Top 0.406: U5.7 U5.6
OUT  (via drill 0.35)
  Top 0.406: 82.55,46.23 74.3,46.23 69.44,41.38 69.44,39.85 68.5,38.91 66.12,38.91 65.41,39.62 40.26,39.62 v38.35,37.72 | R11.2 v38.35,23.24
  Top 0.508: D11.C 77.47,67.56
  Top 1.27: D8.A 80.64,72.39 77.47,69.22 77.47,67.56 77.47,67.44 77.47,67.31 U6.2 77.47,63.5 80.01,60.96
  Bottom 0.406: v38.35,23.24 v38.35,37.72
  pour Top: 95.89,64.9 95.89,69.6 85.22,69.6 79.76,64.14 79.76,29.46 76.58,26.29 76.58,18.67 77.09,18.16 84.84,18.16 84.84,28.07 87.63,30.86 95.89,30.86 95.89,37.72 85.98,37.72 84.71,38.99 84.71,60.83 88.77,64.9
OUT_SW
  Top 0.406: U7.14/A0 29.25,36.79 29.25,38.61 31,40.36 67.28,40.36 R9.P$1
RST
  Top 0.406: J5.4 J6.4 48.26,25.4 U7.8
SCK
  Top 0.406: J5.7 J6.7 50.16,33.02 46.35,36.83 31.94,36.83 30.67,38.1 U7.13
SET
  Top 0.406: C23.+ 68.07,51.05 VR3.3
  Top 0.508: VR2.2 74.93,63.5 | 74.93,63.5 U6.1 | 74.93,63.5 71.81,63.5 C23.+ 65.72,57.4 D11.A D10.A
SET1
  Top 0.406: U2.1 6.86,23.62 C15.+ 8.96,21.59 14.86,21.59 | 14.86,21.59 17.78,21.59 | R2.P$2 14.86,21.59 | R1.P$1 17.78,21.59 | 17.78,21.59 19.05,21.59 20.7,23.24 D7.A
SW
  pour Top (isolate 0.305, rank 4, no thermals): 9.91,49.66 14.86,49.66 15.24,50.04 15.24,56.52 15.24,61.59 12.7,64.14 8.64,64.14 8.64,54.99 8.64,52.96 8.38,52.7 8.38,51.18 9.46,51.18 arc-90 9.91,50.74
TEMP
  Top 0.406: J7.3 75.44,46.99 74.04,46.99 70.23,43.18 60.03,43.18 | 60.03,43.1 C24.1 59.95,42.52 58.41,40.97 30.75,40.97 28.64,38.86 28.64,33.12 29.97,31.79 30.91,31.79 31.84,30.86 31.84,24.25 30.48,22.9 U7.19/A5
  Top 0.508: R20.1 60.03,44.45 60.03,43.18 60.03,43.1
VOUT
  Top 0.406: U7.A11 35.3,17.78 C25.1 36.76,17.77 R12.2 R11.1

### Text on the board
tPlace: Power Supply V3 / 0-20V 0-3A Out / Designed by Isaac Rex | 25-30V In | Amps | Volts
tNames: IN | Volts | Amps | OUT | + | -